# Altium schematic sheet BMS_Protection.SchDoc
size 431 x 279 mm; SheetNumber: 6; SheetTotal: 5
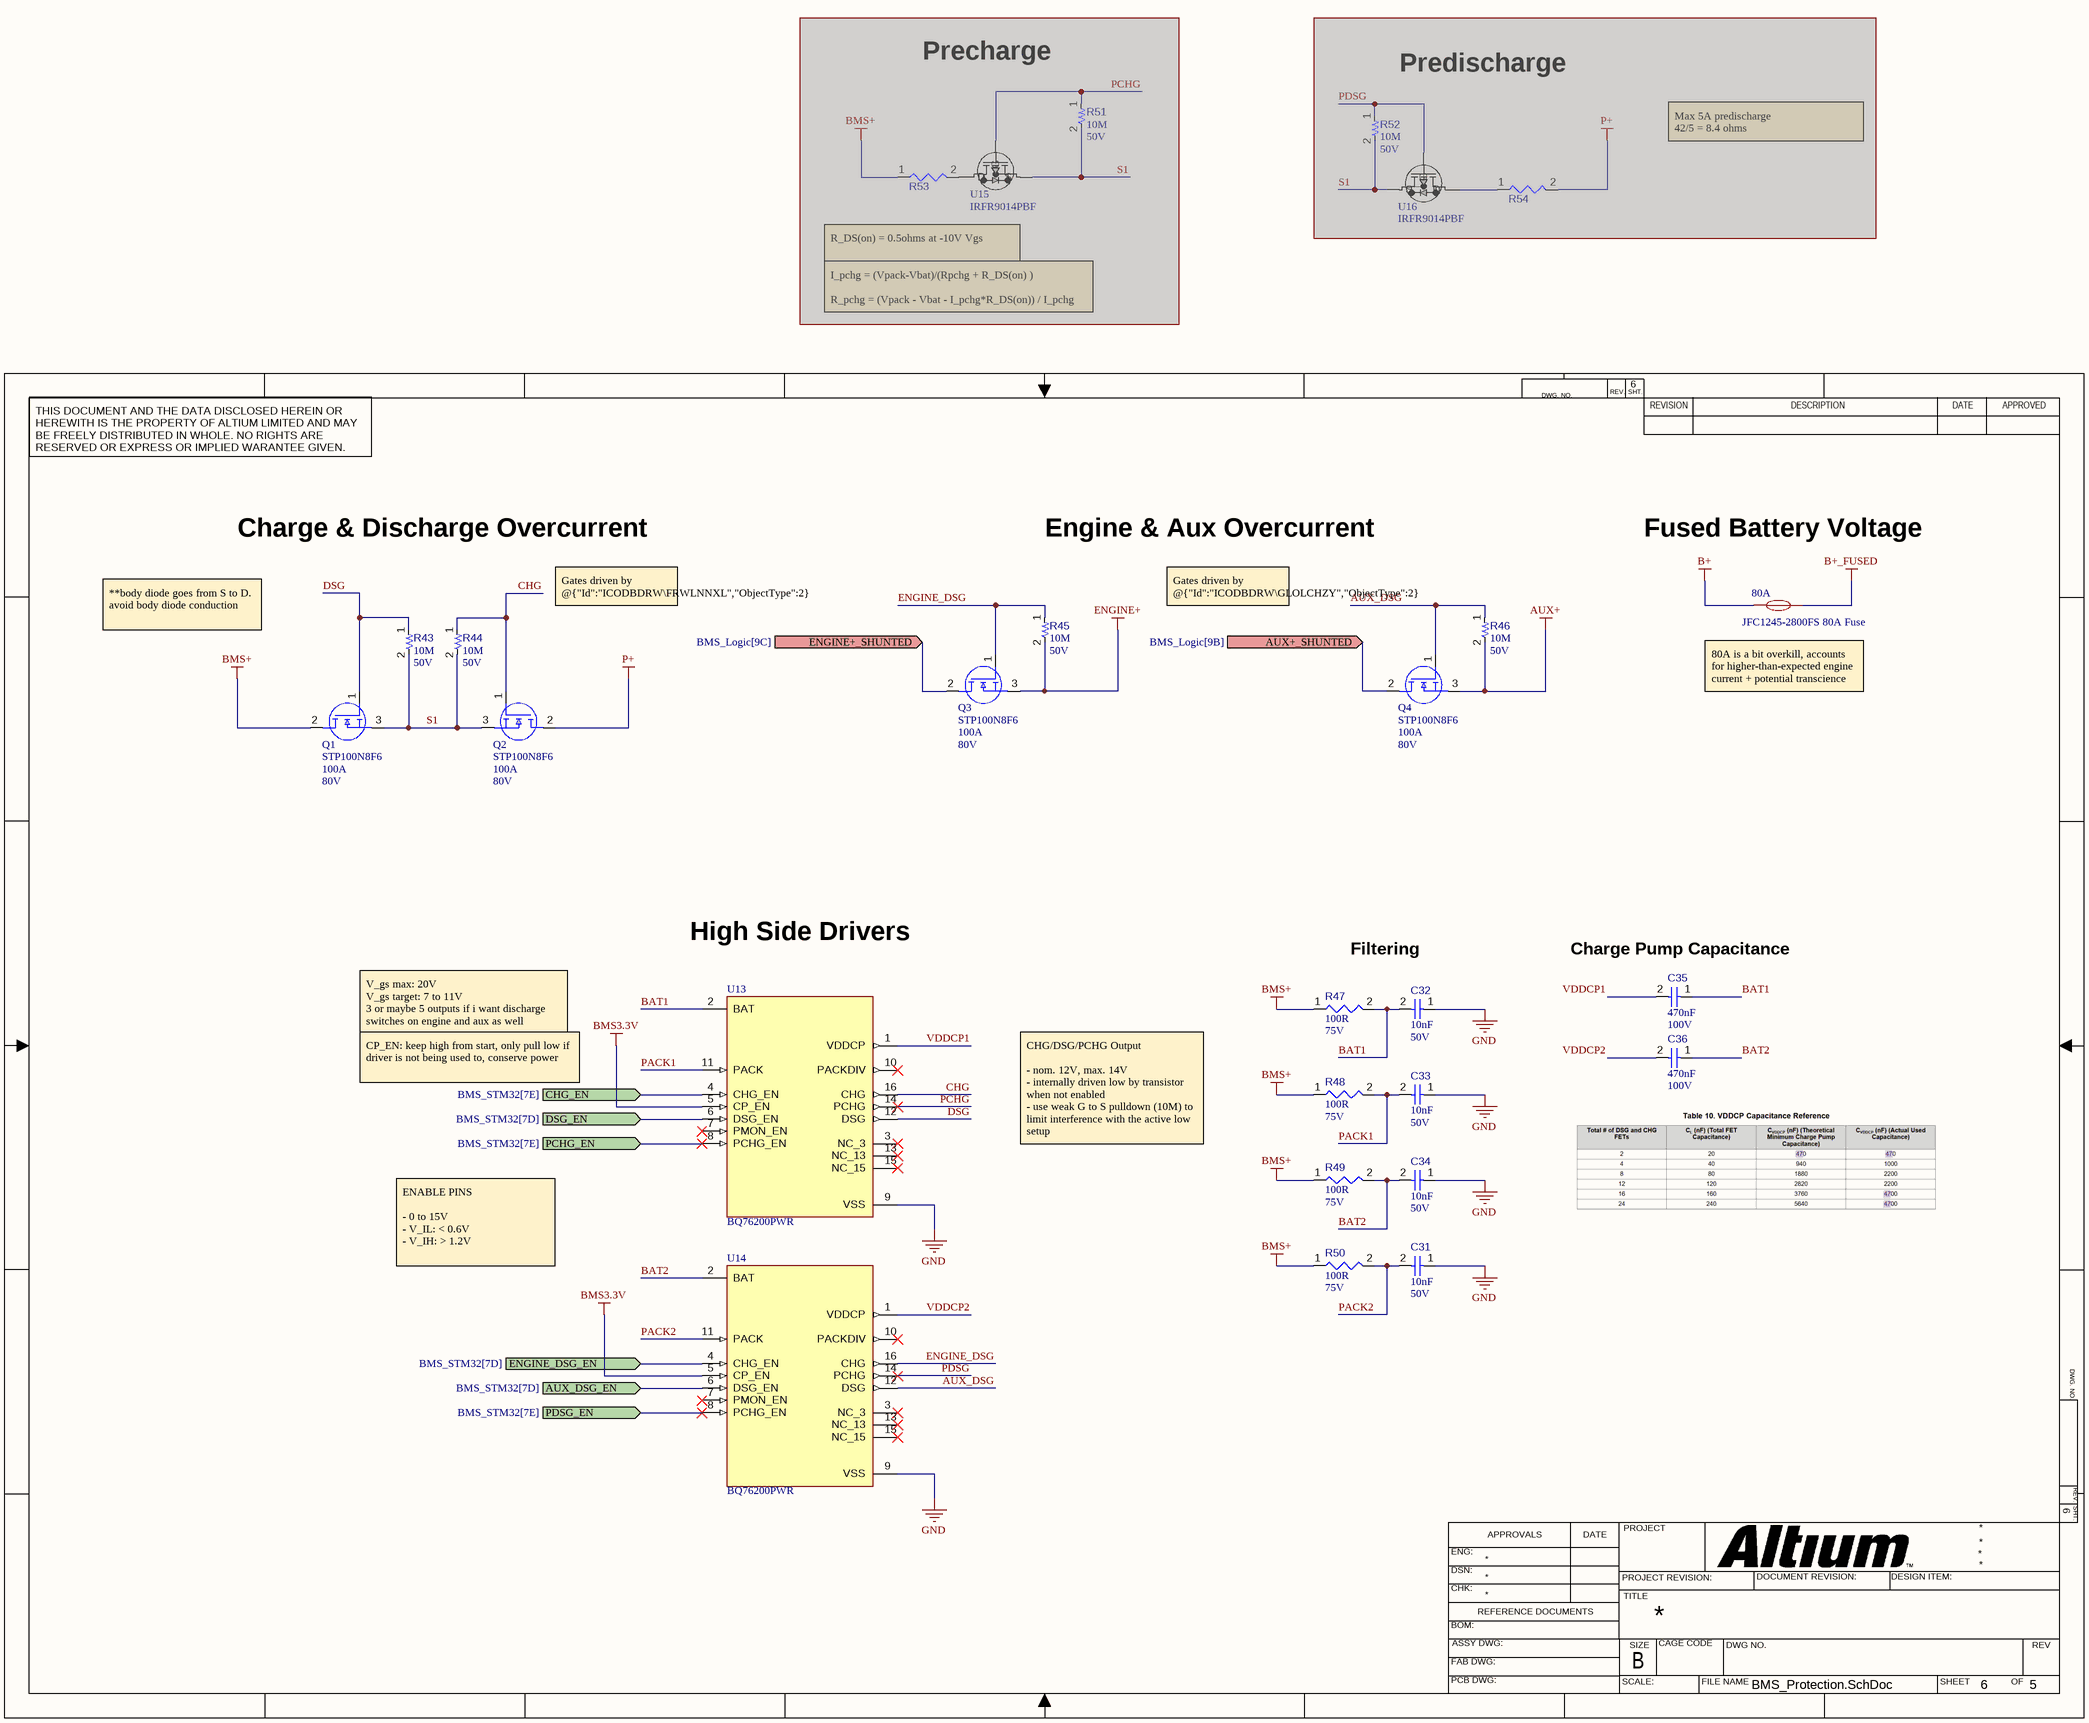
[diagram p0: BMS_Protection.SchDoc]

## Parts
C31  value 10nF  Voltage Rating: 50V  [CAPC0402(1005)60_L]  (hidden comment: CC0603KRX7R0BB103)
C32  value 10nF  Voltage Rating: 50V  [CAPC0402(1005)60_L]  (hidden comment: CC0603KRX7R0BB103)
C33  value 10nF  Voltage Rating: 50V  [CAPC0402(1005)60_L]  (hidden comment: CC0603KRX7R0BB103)
C34  value 10nF  Voltage Rating: 50V  [CAPC0402(1005)60_L]  (hidden comment: CC0603KRX7R0BB103)
C35  value 470nF  Voltage Rating: 100V  [CAPC0805(2012)145_L]  (hidden comment: CC0805KKX7R0BB474)
C36  value 470nF  Voltage Rating: 100V  [CAPC0805(2012)145_L]  (hidden comment: CC0805KKX7R0BB474)
F1  JFC1245-2800FS 80A Fuse  Current Rating: 80A  [FUSE-SMD_L12.5-W4.5]
Q1  STP100N8F6  Drain current continuous at Tc = 25°C: 100A  Drain Source Breakdown Voltage Vds: 80V  [TO255P460X1020X2008-3P]
Q2  STP100N8F6  Drain current continuous at Tc = 25°C: 100A  Drain Source Breakdown Voltage Vds: 80V  [TO255P460X1020X2008-3P]
Q3  STP100N8F6  Drain current continuous at Tc = 25°C: 100A  Drain Source Breakdown Voltage Vds: 80V  [TO255P460X1020X2008-3P]
Q4  STP100N8F6  Drain current continuous at Tc = 25°C: 100A  Drain Source Breakdown Voltage Vds: 80V  [TO255P460X1020X2008-3P]
R43  value 10M  Voltage Rating: 50V  [RESC0402(1005)_L]  (hidden comment: RC0402FR-0710ML)
R44  value 10M  Voltage Rating: 50V  [RESC0402(1005)_L]  (hidden comment: RC0402FR-0710ML)
R45  value 10M  Voltage Rating: 50V  [RESC0402(1005)_L]  (hidden comment: RC0402FR-0710ML)
R46  value 10M  Voltage Rating: 50V  [RESC0402(1005)_L]  (hidden comment: RC0402FR-0710ML)
R47  value 100R  Voltage Rating: 75V  [RESC0603(1608)_L]  (hidden comment: RC0603FR-07100RL)
R48  value 100R  Voltage Rating: 75V  [RESC0603(1608)_L]  (hidden comment: RC0603FR-07100RL)
R49  value 100R  Voltage Rating: 75V  [RESC0603(1608)_L]  (hidden comment: RC0603FR-07100RL)
R50  value 100R  Voltage Rating: 75V  [RESC0603(1608)_L]  (hidden comment: RC0603FR-07100RL)
R51  value 10M  Voltage Rating: 50V  [RESC0402(1005)_L]  (hidden comment: RC0402FR-0710ML)  (masked out: inside a compile mask, not in the netlist)
R52  value 10M  Voltage Rating: 50V  [RESC0402(1005)_L]  (hidden comment: RC0402FR-0710ML)  (masked out: inside a compile mask, not in the netlist)
R53  Resistors  (value not drawn)  (masked out: inside a compile mask, not in the netlist)
R54  Resistors  (value not drawn)  (masked out: inside a compile mask, not in the netlist)
U13  BQ76200PWR  [SOP65P640X120-16N]
U14  BQ76200PWR  [SOP65P640X120-16N]
U15  IRFR9014PBF  [DPAK_VIS]  (masked out: inside a compile mask, not in the netlist)
U16  IRFR9014PBF  [DPAK_VIS]  (masked out: inside a compile mask, not in the netlist)

## Ports
AUX+_SHUNTED (in, see BMS_Logic[9B]), AUX_DSG_EN (in, see BMS_STM32[7D]), CHG_EN (in, see BMS_STM32[7E]), DSG_EN (in, see BMS_STM32[7D]), ENGINE+_SHUNTED (in, see BMS_Logic[9C]), ENGINE_DSG_EN (in, see BMS_STM32[7D]), PCHG_EN (in, see BMS_STM32[7E]), PDSG_EN (in, see BMS_STM32[7E])

## Nets
AUX+: Q4.3(S) R46.2
B+: F1.1
B+_FUSED: F1.2
BMS3.3V: U13.5(CP_EN) U14.5(CP_EN)
BMS+: Q1.2(D) R47.1 R48.1 R49.1 R50.1
ENGINE+: Q3.3(S) R45.2
GND: C31.1 C32.1 C33.1 C34.1 U13.9(VSS) U14.9(VSS)
P+: Q2.2(D)
AUX+_SHUNTED: Q4.2(D) ; port AUX+_SHUNTED
AUX_DSG: Q4.1(G) R46.1 U14.12(DSG)
AUX_DSG_EN: U14.6(DSG_EN) ; port AUX_DSG_EN
BAT1: C32.2 C35.1 R47.2 U13.2(BAT)
BAT2: C34.2 C36.1 R49.2 U14.2(BAT)
CHG: Q2.1(G) R44.1 U13.16(CHG)
CHG_EN: U13.4(CHG_EN) ; port CHG_EN
DSG: Q1.1(G) R43.1 U13.12(DSG)
DSG_EN: U13.6(DSG_EN) ; port DSG_EN
ENGINE+_SHUNTED: Q3.2(D) ; port ENGINE+_SHUNTED
ENGINE_DSG: Q3.1(G) R45.1 U14.16(CHG)
ENGINE_DSG_EN: U14.4(CHG_EN) ; port ENGINE_DSG_EN
PACK1: C33.2 R48.2 U13.11(PACK)
PACK2: C31.2 R50.2 U14.11(PACK)
PCHG: U13.14(PCHG)
PCHG_EN: U13.8(PCHG_EN) ; port PCHG_EN
PDSG: U14.14(PCHG)
PDSG_EN: U14.8(PCHG_EN) ; port PDSG_EN
S1: Q1.3(S) Q2.3(S) R43.2 R44.2
VDDCP1: C35.2 U13.1(VDDCP)
VDDCP2: C36.2 U14.1(VDDCP)

Not connected (* = marked no-connect by the designer): U13 3(NC_3)* 7(PMON_EN)* 10(PACKDIV)* 13(NC_13)* 15(NC_15)*; U14 3(NC_3)* 7(PMON_EN)* 10(PACKDIV)* 13(NC_13)* 15(NC_15)*

## Notes on the sheet
- Precharge
- (near R52) Predischarge
- Max 5A predischarge
  42/5 = 8.4 ohms
- R_DS(on) = 0.5ohms at -10V Vgs
- I_pchg = (Vpack-Vbat)/(Rpchg + R_DS(on) )
  R_pchg = (Vpack - Vbat - I_pchg*R_DS(on)) / I_pchg
- Charge & Discharge Overcurrent
- Engine & Aux Overcurrent
- Fused Battery Voltage
- **body diode goes from S to D. avoid body diode conduction
- Gates driven by @{"Id":"ICODBDRW\FRWLNNXL","ObjectType":2}
- Gates driven by @{"Id":"ICODBDRW\GLOLCHZY","ObjectType":2}
- (near F1) 80A is a bit overkill, accounts for higher-than-expected engine current + potential transcience
- High Side Drivers
- Filtering
- (near C35) Charge Pump Capacitance
- V_gs max: 20V
  V_gs target: 7 to 11V
  3 or maybe 5 outputs if i want discharge switches on engine and aux as well
- CP_EN: keep high from start, only pull low if driver is not being used to, conserve power
- CHG/DSG/PCHG Output
  - nom. 12V, max. 14V
  - internally driven low by transistor when not enabled
  - use weak G to S pulldown (10M) to limit interference with the active low setup
- ENABLE PINS
  - 0 to 15V
  - V_IL: < 0.6V
  - V_IH: > 1.2V
- DWG. NO.
- REV.
- SHT.
- THIS DOCUMENT AND THE DATA DISCLOSED HEREIN OR HEREWITH IS THE PROPERTY OF ALTIUM LIMITED AND MAY BE FREELY DISTRIBUTED IN WHOLE. NO RIGHTS ARE RESERVED OR EXPRESS OR IMPLIED WARANTEE GIVEN.
- REVISION
- DESCRIPTION
- DATE
- APPROVED
- ENG:
- APPROVALS
- PROJECT
- DSN:
- CHK:
- REFERENCE DOCUMENTS
- PROJECT REVISION:
- TITLE
- DOCUMENT REVISION:
- DESIGN ITEM:
- BOM:
- FAB DWG:
- PCB DWG:
- ASSY DWG:
- SCALE:
- SIZE
- B
- CAGE CODE
- FILE NAME
- DWG NO.
- SHEET
- OF
- REV

## Library data of the parts
C31-C34 = CMP-001-00069-3: Chip Capacitor, 10nF +/-20%, 50V, 0402, Thickness 0.6 mm; Tolerance: 5%; Mounting Technology: SMT; Case/Package: 0402; Pins: 2; Min Operating Temperature: -55°C; Max Operating Temperature: 85°C
C35 C36 = CMP-001-00082-4: Chip Capacitor, 47µF +/-40%, 6.3V, 0805, Thickness 1.45 mm; Tolerance: 10%; Mounting Technology: SMT; Case/Package: 0805; Pins: 2; Min Operating Temperature: -55°C; Max Operating Temperature: 85°C
F1 = CMP-005-00013-2: Manufacturer: JDTfuse(集电通); Voltage Rating (AC): 600V; Add into BOM: yes; Voltage Rating (DC): 250V; Type: Surface Mount Fuse; Melting I2t: 5270; Datasheet: https://atta.szlcsc.com/upload/public/pdf/source/20250508/CF412184D6CDD19FE95AA7AB21E198C3.pdf; Design Item ID: JFC1245-2800FS; JLCPCB Part Class: Extended Part; Operating Temperature: -55℃~+125℃; LCSC Part Name: 一次性熔断保险丝; Supplier Part: C48783191; Length: 12.45mm; Device: JFC1245-2800FS; Source: JFC1245-2800FS1_JFC1245-2800FS.SCHLIB; Symbol: JFC1245-2800FS; Manufacturer Part: JFC1245-2800FS; Supplier Footprint: SMD,12.5x4.5mm; Convert to PCB: yes; Width: 4.5mm
Q1-Q4 = CMP-120-000000-8: MOSFET POWER MOSFET; Manufacturer_Name: STMicroelectronics; Geometry.Height: 4.6mm; Vgs (Max): 20V; Drain current continuous at Tc = 100°C: 70A; Nominal Vgs: 3V; RtjA: 62.5°C/W; Pulsed Drain Current: 400A; RtjC: 0.85°C/W; Forward On Voltage (Vgs = 0V, Isd = 100A): 1.2V; Source: STP100N8F6.SchLib; Manufacturer_Part_Number: STP100N8F6; Design Item ID: STP100N8F6; Datasheet Link: https://www.st.com/resource/en/datasheet/stp100n8f6.pdf; Mouser Part Number: 511-STP100N8F6; Mouser Price/Stock: https://www.mouser.co.uk/ProductDetail/STMicroelectronics/STP100N8F6?qs=JkuGhO7zlpk0tv8q3dz9Ww%3D%3D; Min Operating Temperature: -55°C; Max Operating Temperature: 175°C; Transistor Type: MOSFET
R43-R46 R51 R52 = CMP-009-00065-4: 100R 0.063W 1% 0402 (1005 Metric)  SMD; Power: 63mW; Mounting Technology: SMT; Case/Package: 0402; Pins: 2; Tolerance: 1%
R47-R50 = CMP-009-00069-2: 120R 0.1W 5% 0603 (1608 Metric)  SMD; Power: 100mW; Mounting Technology: SMT; Case/Package: 0603; Pins: 2; Tolerance: 5%
R53 R54 = Resistors: Resistor; Component Type: Resistors
U13 U14 = CMP-122-000000-1: High-side n-channel FET driver; MF: Texas Instruments; Source: BQ76200PWR.SchLib; Value: *; Pin Count: 16; MP: BQ76200PWR; Package: TSSOP-16 Texas Instruments; Component Type: Standard; Design Item ID: BQ76200PWR; Check_prices: https://www.snapeda.com/parts/BQ76200PWR/Texas+Instruments/view-part/?ref=eda; SnapEDA_Link: https://www.snapeda.com/parts/BQ76200PWR/Texas+Instruments/view-part/?ref=snap
U15 U16 = CMP-125-000000-1: MOSFET P-CHANNEL 60V; Manufacturer_Name: Vishay; Source: IRFR9014PBF.SchLib; Datasheet: https://www.vishay.com/doc?91277; Copyright: Copyright (C) 2025 Ultra Librarian. All rights reserved.; Manufacturer_Part_Number: IRFR9014PBF; Design Item ID: IRFR9014PBF